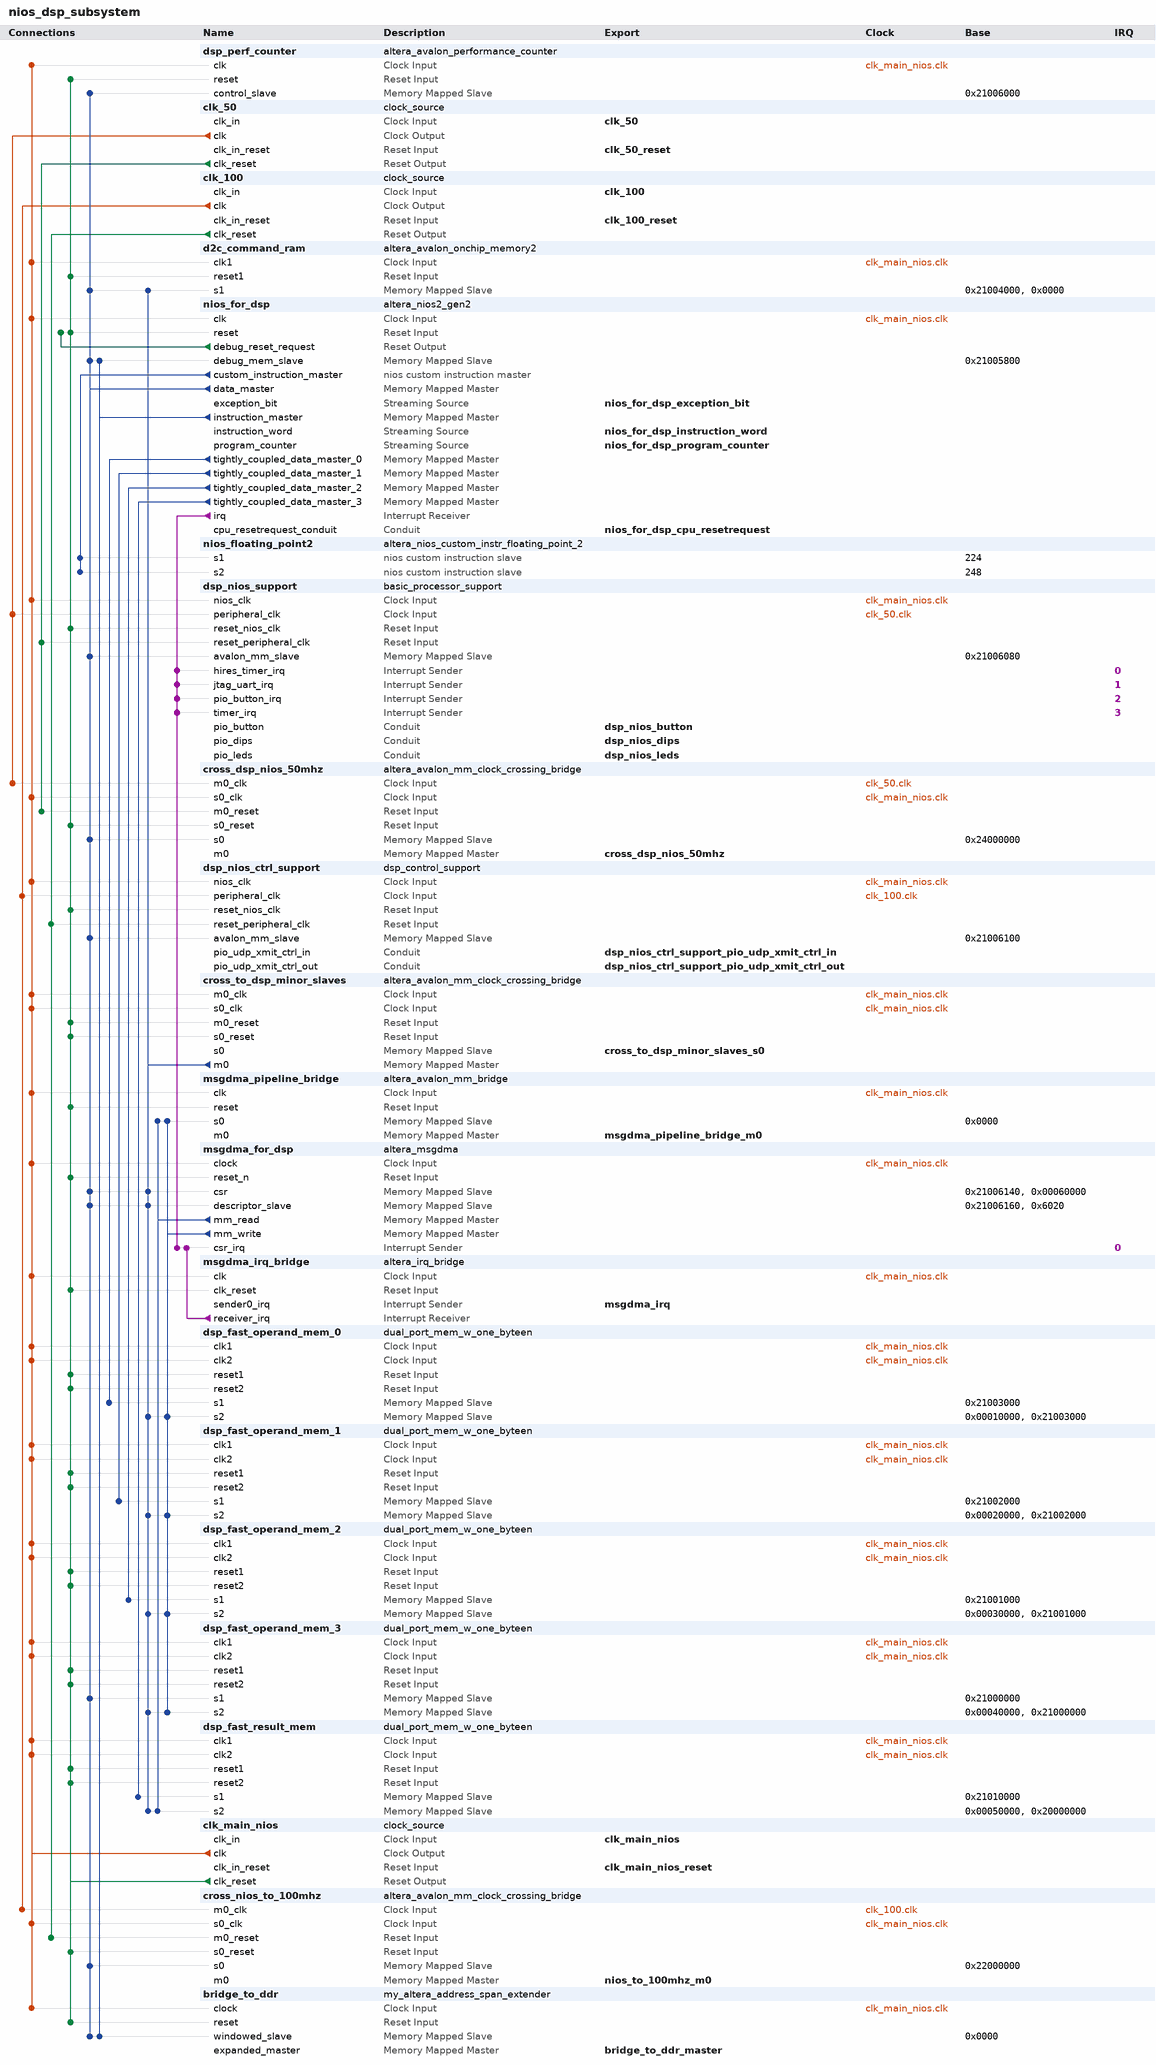
[diagram p0: system contents]
# Platform Designer (Qsys) system nios_dsp_subsystem, Arria V 5AGXFB5H4F35C4
# Parameters at their usual value, and those the tool derives, are not listed.
package require -exact qsys 16.1
create_system nios_dsp_subsystem
set_project_property DEVICE_FAMILY {Arria V}
set_project_property DEVICE 5AGXFB5H4F35C4

add_instance dsp_perf_counter altera_avalon_performance_counter 16.1
set_instance_parameter_value dsp_perf_counter numberOfSections 7

add_instance clk_50 clock_source 16.1
set_instance_parameter_value clk_50 clockFrequency 50000000
set_instance_parameter_value clk_50 resetSynchronousEdges BOTH

add_instance clk_100 clock_source 16.1
set_instance_parameter_value clk_100 clockFrequency 100000000
set_instance_parameter_value clk_100 resetSynchronousEdges BOTH

add_instance d2c_command_ram altera_avalon_onchip_memory2 16.1
set_instance_parameter_value d2c_command_ram allowInSystemMemoryContentEditor true
set_instance_parameter_value d2c_command_ram dataWidth 32
set_instance_parameter_value d2c_command_ram dualPort false
set_instance_parameter_value d2c_command_ram initMemContent true
set_instance_parameter_value d2c_command_ram initializationFileName onchip_mem.hex
set_instance_parameter_value d2c_command_ram instanceID d2c
set_instance_parameter_value d2c_command_ram memorySize 4096
set_instance_parameter_value d2c_command_ram slave1Latency 2

add_instance nios_for_dsp altera_nios2_gen2 16.1
set_instance_parameter_value nios_for_dsp cpuID 3419
set_instance_parameter_value nios_for_dsp cpuReset true
set_instance_parameter_value nios_for_dsp dcache_numTCDM 4
set_instance_parameter_value nios_for_dsp dcache_size 0
set_instance_parameter_value nios_for_dsp dividerType srt2
set_instance_parameter_value nios_for_dsp exceptionSlave bridge_to_ddr.windowed_slave
set_instance_parameter_value nios_for_dsp icache_burstType Sequential
set_instance_parameter_value nios_for_dsp icache_size 16384
set_instance_parameter_value nios_for_dsp impl Fast
set_instance_parameter_value nios_for_dsp mul_32_impl 3
set_instance_parameter_value nios_for_dsp mul_shift_choice 1
set_instance_parameter_value nios_for_dsp resetSlave bridge_to_ddr.windowed_slave
set_instance_parameter_value nios_for_dsp setting_showUnpublishedSettings true

add_instance nios_floating_point2 altera_nios_custom_instr_floating_point_2 16.1
set_instance_parameter_value nios_floating_point2 arithmetic_present true
set_instance_parameter_value nios_floating_point2 comparison_present true
set_instance_parameter_value nios_floating_point2 conversion_present true
set_instance_parameter_value nios_floating_point2 root_present true

add_instance dsp_nios_support basic_processor_support 1.0

add_instance cross_dsp_nios_50mhz altera_avalon_mm_clock_crossing_bridge 16.1
set_instance_parameter_value cross_dsp_nios_50mhz ADDRESS_WIDTH 10
set_instance_parameter_value cross_dsp_nios_50mhz COMMAND_FIFO_DEPTH 4
set_instance_parameter_value cross_dsp_nios_50mhz DATA_WIDTH 32
set_instance_parameter_value cross_dsp_nios_50mhz MASTER_SYNC_DEPTH 2
set_instance_parameter_value cross_dsp_nios_50mhz MAX_BURST_SIZE 1
set_instance_parameter_value cross_dsp_nios_50mhz RESPONSE_FIFO_DEPTH 4
set_instance_parameter_value cross_dsp_nios_50mhz SLAVE_SYNC_DEPTH 2
set_instance_parameter_value cross_dsp_nios_50mhz USE_AUTO_ADDRESS_WIDTH 1

add_instance dsp_nios_ctrl_support dsp_control_support 1.0

add_instance cross_to_dsp_minor_slaves altera_avalon_mm_clock_crossing_bridge 16.1
set_instance_parameter_value cross_to_dsp_minor_slaves ADDRESS_WIDTH 10
set_instance_parameter_value cross_to_dsp_minor_slaves COMMAND_FIFO_DEPTH 16
set_instance_parameter_value cross_to_dsp_minor_slaves DATA_WIDTH 128
set_instance_parameter_value cross_to_dsp_minor_slaves MASTER_SYNC_DEPTH 2
set_instance_parameter_value cross_to_dsp_minor_slaves MAX_BURST_SIZE 1
set_instance_parameter_value cross_to_dsp_minor_slaves RESPONSE_FIFO_DEPTH 16
set_instance_parameter_value cross_to_dsp_minor_slaves SLAVE_SYNC_DEPTH 2
set_instance_parameter_value cross_to_dsp_minor_slaves USE_AUTO_ADDRESS_WIDTH 1

add_instance msgdma_pipeline_bridge altera_avalon_mm_bridge 16.1
set_instance_parameter_value msgdma_pipeline_bridge ADDRESS_UNITS SYMBOLS
set_instance_parameter_value msgdma_pipeline_bridge ADDRESS_WIDTH 10
set_instance_parameter_value msgdma_pipeline_bridge DATA_WIDTH 256
set_instance_parameter_value msgdma_pipeline_bridge MAX_BURST_SIZE 8
set_instance_parameter_value msgdma_pipeline_bridge MAX_PENDING_RESPONSES 4
set_instance_parameter_value msgdma_pipeline_bridge USE_AUTO_ADDRESS_WIDTH 1

add_instance msgdma_for_dsp altera_msgdma 16.1
set_instance_parameter_value msgdma_for_dsp BURST_ENABLE 1
set_instance_parameter_value msgdma_for_dsp BURST_WRAPPING_SUPPORT 1
set_instance_parameter_value msgdma_for_dsp DATA_FIFO_DEPTH 32
set_instance_parameter_value msgdma_for_dsp DATA_WIDTH 128
set_instance_parameter_value msgdma_for_dsp DESCRIPTOR_FIFO_DEPTH 128
set_instance_parameter_value msgdma_for_dsp ENHANCED_FEATURES 0
set_instance_parameter_value msgdma_for_dsp ERROR_ENABLE 0
set_instance_parameter_value msgdma_for_dsp MAX_BURST_COUNT 8
set_instance_parameter_value msgdma_for_dsp MAX_BYTE 67108864
set_instance_parameter_value msgdma_for_dsp MODE 0
set_instance_parameter_value msgdma_for_dsp PACKET_ENABLE 0
set_instance_parameter_value msgdma_for_dsp TRANSFER_TYPE {Aligned Accesses}
set_instance_parameter_value msgdma_for_dsp USE_FIX_ADDRESS_WIDTH 1

add_instance msgdma_irq_bridge altera_irq_bridge 16.1
set_instance_parameter_value msgdma_irq_bridge IRQ_WIDTH 1

add_instance dsp_fast_operand_mem_0 dual_port_mem_w_one_byteen 16.1
set_instance_parameter_value dsp_fast_operand_mem_0 allowInSystemMemoryContentEditor false
set_instance_parameter_value dsp_fast_operand_mem_0 blockType AUTO
set_instance_parameter_value dsp_fast_operand_mem_0 copyInitFile false
set_instance_parameter_value dsp_fast_operand_mem_0 dataWidth 32
set_instance_parameter_value dsp_fast_operand_mem_0 dataWidth2 128
set_instance_parameter_value dsp_fast_operand_mem_0 dualPort true
set_instance_parameter_value dsp_fast_operand_mem_0 ecc_enabled false
set_instance_parameter_value dsp_fast_operand_mem_0 enPRInitMode false
set_instance_parameter_value dsp_fast_operand_mem_0 enableDiffWidth true
set_instance_parameter_value dsp_fast_operand_mem_0 initMemContent true
set_instance_parameter_value dsp_fast_operand_mem_0 initializationFileName onchip_mem.hex
set_instance_parameter_value dsp_fast_operand_mem_0 instanceID NONE
set_instance_parameter_value dsp_fast_operand_mem_0 memorySize 4096
set_instance_parameter_value dsp_fast_operand_mem_0 readDuringWriteMode DONT_CARE
set_instance_parameter_value dsp_fast_operand_mem_0 resetrequest_enabled true
set_instance_parameter_value dsp_fast_operand_mem_0 simAllowMRAMContentsFile false
set_instance_parameter_value dsp_fast_operand_mem_0 simMemInitOnlyFilename 0
set_instance_parameter_value dsp_fast_operand_mem_0 singleClockOperation false
set_instance_parameter_value dsp_fast_operand_mem_0 slave1Latency 1
set_instance_parameter_value dsp_fast_operand_mem_0 slave2Latency 1
set_instance_parameter_value dsp_fast_operand_mem_0 useNonDefaultInitFile false
set_instance_parameter_value dsp_fast_operand_mem_0 useShallowMemBlocks false
set_instance_parameter_value dsp_fast_operand_mem_0 writable true

add_instance dsp_fast_operand_mem_1 dual_port_mem_w_one_byteen 16.1
set_instance_parameter_value dsp_fast_operand_mem_1 allowInSystemMemoryContentEditor false
set_instance_parameter_value dsp_fast_operand_mem_1 blockType AUTO
set_instance_parameter_value dsp_fast_operand_mem_1 copyInitFile false
set_instance_parameter_value dsp_fast_operand_mem_1 dataWidth 32
set_instance_parameter_value dsp_fast_operand_mem_1 dataWidth2 128
set_instance_parameter_value dsp_fast_operand_mem_1 dualPort true
set_instance_parameter_value dsp_fast_operand_mem_1 ecc_enabled false
set_instance_parameter_value dsp_fast_operand_mem_1 enPRInitMode false
set_instance_parameter_value dsp_fast_operand_mem_1 enableDiffWidth true
set_instance_parameter_value dsp_fast_operand_mem_1 initMemContent true
set_instance_parameter_value dsp_fast_operand_mem_1 initializationFileName onchip_mem.hex
set_instance_parameter_value dsp_fast_operand_mem_1 instanceID NONE
set_instance_parameter_value dsp_fast_operand_mem_1 memorySize 4096
set_instance_parameter_value dsp_fast_operand_mem_1 readDuringWriteMode DONT_CARE
set_instance_parameter_value dsp_fast_operand_mem_1 resetrequest_enabled true
set_instance_parameter_value dsp_fast_operand_mem_1 simAllowMRAMContentsFile false
set_instance_parameter_value dsp_fast_operand_mem_1 simMemInitOnlyFilename 0
set_instance_parameter_value dsp_fast_operand_mem_1 singleClockOperation false
set_instance_parameter_value dsp_fast_operand_mem_1 slave1Latency 1
set_instance_parameter_value dsp_fast_operand_mem_1 slave2Latency 1
set_instance_parameter_value dsp_fast_operand_mem_1 useNonDefaultInitFile false
set_instance_parameter_value dsp_fast_operand_mem_1 useShallowMemBlocks false
set_instance_parameter_value dsp_fast_operand_mem_1 writable true

add_instance dsp_fast_operand_mem_2 dual_port_mem_w_one_byteen 16.1
set_instance_parameter_value dsp_fast_operand_mem_2 allowInSystemMemoryContentEditor false
set_instance_parameter_value dsp_fast_operand_mem_2 blockType AUTO
set_instance_parameter_value dsp_fast_operand_mem_2 copyInitFile false
set_instance_parameter_value dsp_fast_operand_mem_2 dataWidth 32
set_instance_parameter_value dsp_fast_operand_mem_2 dataWidth2 128
set_instance_parameter_value dsp_fast_operand_mem_2 dualPort true
set_instance_parameter_value dsp_fast_operand_mem_2 ecc_enabled false
set_instance_parameter_value dsp_fast_operand_mem_2 enPRInitMode false
set_instance_parameter_value dsp_fast_operand_mem_2 enableDiffWidth true
set_instance_parameter_value dsp_fast_operand_mem_2 initMemContent true
set_instance_parameter_value dsp_fast_operand_mem_2 initializationFileName onchip_mem.hex
set_instance_parameter_value dsp_fast_operand_mem_2 instanceID NONE
set_instance_parameter_value dsp_fast_operand_mem_2 memorySize 4096
set_instance_parameter_value dsp_fast_operand_mem_2 readDuringWriteMode DONT_CARE
set_instance_parameter_value dsp_fast_operand_mem_2 resetrequest_enabled true
set_instance_parameter_value dsp_fast_operand_mem_2 simAllowMRAMContentsFile false
set_instance_parameter_value dsp_fast_operand_mem_2 simMemInitOnlyFilename 0
set_instance_parameter_value dsp_fast_operand_mem_2 singleClockOperation false
set_instance_parameter_value dsp_fast_operand_mem_2 slave1Latency 1
set_instance_parameter_value dsp_fast_operand_mem_2 slave2Latency 1
set_instance_parameter_value dsp_fast_operand_mem_2 useNonDefaultInitFile false
set_instance_parameter_value dsp_fast_operand_mem_2 useShallowMemBlocks false
set_instance_parameter_value dsp_fast_operand_mem_2 writable true

add_instance dsp_fast_operand_mem_3 dual_port_mem_w_one_byteen 16.1
set_instance_parameter_value dsp_fast_operand_mem_3 allowInSystemMemoryContentEditor false
set_instance_parameter_value dsp_fast_operand_mem_3 blockType AUTO
set_instance_parameter_value dsp_fast_operand_mem_3 copyInitFile false
set_instance_parameter_value dsp_fast_operand_mem_3 dataWidth 32
set_instance_parameter_value dsp_fast_operand_mem_3 dataWidth2 128
set_instance_parameter_value dsp_fast_operand_mem_3 dualPort true
set_instance_parameter_value dsp_fast_operand_mem_3 ecc_enabled false
set_instance_parameter_value dsp_fast_operand_mem_3 enPRInitMode false
set_instance_parameter_value dsp_fast_operand_mem_3 enableDiffWidth true
set_instance_parameter_value dsp_fast_operand_mem_3 initMemContent true
set_instance_parameter_value dsp_fast_operand_mem_3 initializationFileName onchip_mem.hex
set_instance_parameter_value dsp_fast_operand_mem_3 instanceID NONE
set_instance_parameter_value dsp_fast_operand_mem_3 memorySize 4096
set_instance_parameter_value dsp_fast_operand_mem_3 readDuringWriteMode DONT_CARE
set_instance_parameter_value dsp_fast_operand_mem_3 resetrequest_enabled true
set_instance_parameter_value dsp_fast_operand_mem_3 simAllowMRAMContentsFile false
set_instance_parameter_value dsp_fast_operand_mem_3 simMemInitOnlyFilename 0
set_instance_parameter_value dsp_fast_operand_mem_3 singleClockOperation false
set_instance_parameter_value dsp_fast_operand_mem_3 slave1Latency 1
set_instance_parameter_value dsp_fast_operand_mem_3 slave2Latency 1
set_instance_parameter_value dsp_fast_operand_mem_3 useNonDefaultInitFile false
set_instance_parameter_value dsp_fast_operand_mem_3 useShallowMemBlocks false
set_instance_parameter_value dsp_fast_operand_mem_3 writable true

add_instance dsp_fast_result_mem dual_port_mem_w_one_byteen 16.1
set_instance_parameter_value dsp_fast_result_mem allowInSystemMemoryContentEditor false
set_instance_parameter_value dsp_fast_result_mem blockType AUTO
set_instance_parameter_value dsp_fast_result_mem copyInitFile false
set_instance_parameter_value dsp_fast_result_mem dataWidth 32
set_instance_parameter_value dsp_fast_result_mem dataWidth2 128
set_instance_parameter_value dsp_fast_result_mem dualPort true
set_instance_parameter_value dsp_fast_result_mem ecc_enabled false
set_instance_parameter_value dsp_fast_result_mem enPRInitMode false
set_instance_parameter_value dsp_fast_result_mem enableDiffWidth true
set_instance_parameter_value dsp_fast_result_mem initMemContent true
set_instance_parameter_value dsp_fast_result_mem initializationFileName onchip_mem.hex
set_instance_parameter_value dsp_fast_result_mem instanceID NONE
set_instance_parameter_value dsp_fast_result_mem memorySize 4096
set_instance_parameter_value dsp_fast_result_mem readDuringWriteMode DONT_CARE
set_instance_parameter_value dsp_fast_result_mem resetrequest_enabled true
set_instance_parameter_value dsp_fast_result_mem simAllowMRAMContentsFile false
set_instance_parameter_value dsp_fast_result_mem simMemInitOnlyFilename 0
set_instance_parameter_value dsp_fast_result_mem singleClockOperation false
set_instance_parameter_value dsp_fast_result_mem slave1Latency 1
set_instance_parameter_value dsp_fast_result_mem slave2Latency 1
set_instance_parameter_value dsp_fast_result_mem useNonDefaultInitFile false
set_instance_parameter_value dsp_fast_result_mem useShallowMemBlocks false
set_instance_parameter_value dsp_fast_result_mem writable true

add_instance clk_main_nios clock_source 16.1
set_instance_parameter_value clk_main_nios clockFrequency 150000000
set_instance_parameter_value clk_main_nios resetSynchronousEdges BOTH

add_instance cross_nios_to_100mhz altera_avalon_mm_clock_crossing_bridge 16.1
set_instance_parameter_value cross_nios_to_100mhz ADDRESS_WIDTH 28
set_instance_parameter_value cross_nios_to_100mhz COMMAND_FIFO_DEPTH 4
set_instance_parameter_value cross_nios_to_100mhz DATA_WIDTH 32
set_instance_parameter_value cross_nios_to_100mhz MASTER_SYNC_DEPTH 2
set_instance_parameter_value cross_nios_to_100mhz MAX_BURST_SIZE 1
set_instance_parameter_value cross_nios_to_100mhz RESPONSE_FIFO_DEPTH 4
set_instance_parameter_value cross_nios_to_100mhz SLAVE_SYNC_DEPTH 2
set_instance_parameter_value cross_nios_to_100mhz USE_AUTO_ADDRESS_WIDTH 1

add_instance bridge_to_ddr my_altera_address_span_extender 16.1
set_instance_parameter_value bridge_to_ddr BURSTCOUNT_WIDTH 4
set_instance_parameter_value bridge_to_ddr DATA_WIDTH 256
set_instance_parameter_value bridge_to_ddr ENABLE_SLAVE_PORT true
set_instance_parameter_value bridge_to_ddr MASTER_ADDRESS_DEF 0
set_instance_parameter_value bridge_to_ddr MASTER_ADDRESS_WIDTH 32
set_instance_parameter_value bridge_to_ddr MAX_PENDING_READS 32
set_instance_parameter_value bridge_to_ddr SLAVE_ADDRESS_WIDTH 24
set_instance_parameter_value bridge_to_ddr SUB_WINDOW_COUNT 1

# connections
add_connection clk_50.clk cross_dsp_nios_50mhz.m0_clk clock
add_connection clk_50.clk dsp_nios_support.peripheral_clk clock
add_connection clk_100.clk cross_nios_to_100mhz.m0_clk clock
add_connection clk_100.clk dsp_nios_ctrl_support.peripheral_clk clock
add_connection clk_main_nios.clk bridge_to_ddr.clock clock
add_connection clk_main_nios.clk cross_dsp_nios_50mhz.s0_clk clock
add_connection clk_main_nios.clk cross_nios_to_100mhz.s0_clk clock
add_connection clk_main_nios.clk cross_to_dsp_minor_slaves.m0_clk clock
add_connection clk_main_nios.clk cross_to_dsp_minor_slaves.s0_clk clock
add_connection clk_main_nios.clk d2c_command_ram.clk1 clock
add_connection clk_main_nios.clk dsp_fast_operand_mem_0.clk1 clock
add_connection clk_main_nios.clk dsp_fast_operand_mem_0.clk2 clock
add_connection clk_main_nios.clk dsp_fast_operand_mem_1.clk1 clock
add_connection clk_main_nios.clk dsp_fast_operand_mem_1.clk2 clock
add_connection clk_main_nios.clk dsp_fast_operand_mem_2.clk1 clock
add_connection clk_main_nios.clk dsp_fast_operand_mem_2.clk2 clock
add_connection clk_main_nios.clk dsp_fast_operand_mem_3.clk1 clock
add_connection clk_main_nios.clk dsp_fast_operand_mem_3.clk2 clock
add_connection clk_main_nios.clk dsp_fast_result_mem.clk1 clock
add_connection clk_main_nios.clk dsp_fast_result_mem.clk2 clock
add_connection clk_main_nios.clk dsp_nios_ctrl_support.nios_clk clock
add_connection clk_main_nios.clk dsp_nios_support.nios_clk clock
add_connection clk_main_nios.clk dsp_perf_counter.clk clock
add_connection clk_main_nios.clk msgdma_for_dsp.clock clock
add_connection clk_main_nios.clk msgdma_irq_bridge.clk clock
add_connection clk_main_nios.clk msgdma_pipeline_bridge.clk clock
add_connection clk_main_nios.clk nios_for_dsp.clk clock
add_connection clk_50.clk_reset cross_dsp_nios_50mhz.m0_reset reset
add_connection clk_50.clk_reset dsp_nios_support.reset_peripheral_clk reset
add_connection clk_100.clk_reset cross_nios_to_100mhz.m0_reset reset
add_connection clk_100.clk_reset dsp_nios_ctrl_support.reset_peripheral_clk reset
add_connection clk_main_nios.clk_reset bridge_to_ddr.reset reset
add_connection clk_main_nios.clk_reset cross_dsp_nios_50mhz.s0_reset reset
add_connection clk_main_nios.clk_reset cross_nios_to_100mhz.s0_reset reset
add_connection clk_main_nios.clk_reset cross_to_dsp_minor_slaves.m0_reset reset
add_connection clk_main_nios.clk_reset cross_to_dsp_minor_slaves.s0_reset reset
add_connection clk_main_nios.clk_reset d2c_command_ram.reset1 reset
add_connection clk_main_nios.clk_reset dsp_fast_operand_mem_0.reset1 reset
add_connection clk_main_nios.clk_reset dsp_fast_operand_mem_0.reset2 reset
add_connection clk_main_nios.clk_reset dsp_fast_operand_mem_1.reset1 reset
add_connection clk_main_nios.clk_reset dsp_fast_operand_mem_1.reset2 reset
add_connection clk_main_nios.clk_reset dsp_fast_operand_mem_2.reset1 reset
add_connection clk_main_nios.clk_reset dsp_fast_operand_mem_2.reset2 reset
add_connection clk_main_nios.clk_reset dsp_fast_operand_mem_3.reset1 reset
add_connection clk_main_nios.clk_reset dsp_fast_operand_mem_3.reset2 reset
add_connection clk_main_nios.clk_reset dsp_fast_result_mem.reset1 reset
add_connection clk_main_nios.clk_reset dsp_fast_result_mem.reset2 reset
add_connection clk_main_nios.clk_reset dsp_nios_ctrl_support.reset_nios_clk reset
add_connection clk_main_nios.clk_reset dsp_nios_support.reset_nios_clk reset
add_connection clk_main_nios.clk_reset dsp_perf_counter.reset reset
add_connection clk_main_nios.clk_reset msgdma_for_dsp.reset_n reset
add_connection clk_main_nios.clk_reset msgdma_irq_bridge.clk_reset reset
add_connection clk_main_nios.clk_reset msgdma_pipeline_bridge.reset reset
add_connection clk_main_nios.clk_reset nios_for_dsp.reset reset
add_connection nios_for_dsp.debug_reset_request nios_for_dsp.reset reset
add_connection cross_to_dsp_minor_slaves.m0 d2c_command_ram.s1 avalon
set_connection_parameter_value cross_to_dsp_minor_slaves.m0/d2c_command_ram.s1 baseAddress 0x0000
add_connection cross_to_dsp_minor_slaves.m0 dsp_fast_operand_mem_0.s2 avalon
set_connection_parameter_value cross_to_dsp_minor_slaves.m0/dsp_fast_operand_mem_0.s2 baseAddress 0x00010000
add_connection cross_to_dsp_minor_slaves.m0 dsp_fast_operand_mem_1.s2 avalon
set_connection_parameter_value cross_to_dsp_minor_slaves.m0/dsp_fast_operand_mem_1.s2 baseAddress 0x00020000
add_connection cross_to_dsp_minor_slaves.m0 dsp_fast_operand_mem_2.s2 avalon
set_connection_parameter_value cross_to_dsp_minor_slaves.m0/dsp_fast_operand_mem_2.s2 baseAddress 0x00030000
add_connection cross_to_dsp_minor_slaves.m0 dsp_fast_operand_mem_3.s2 avalon
set_connection_parameter_value cross_to_dsp_minor_slaves.m0/dsp_fast_operand_mem_3.s2 baseAddress 0x00040000
add_connection cross_to_dsp_minor_slaves.m0 dsp_fast_result_mem.s2 avalon
set_connection_parameter_value cross_to_dsp_minor_slaves.m0/dsp_fast_result_mem.s2 baseAddress 0x00050000
add_connection cross_to_dsp_minor_slaves.m0 msgdma_for_dsp.csr avalon
set_connection_parameter_value cross_to_dsp_minor_slaves.m0/msgdma_for_dsp.csr baseAddress 0x00060000
add_connection cross_to_dsp_minor_slaves.m0 msgdma_for_dsp.descriptor_slave avalon
set_connection_parameter_value cross_to_dsp_minor_slaves.m0/msgdma_for_dsp.descriptor_slave baseAddress 0x6020
add_connection msgdma_for_dsp.mm_read dsp_fast_result_mem.s2 avalon
set_connection_parameter_value msgdma_for_dsp.mm_read/dsp_fast_result_mem.s2 baseAddress 0x20000000
add_connection msgdma_for_dsp.mm_read msgdma_pipeline_bridge.s0 avalon
set_connection_parameter_value msgdma_for_dsp.mm_read/msgdma_pipeline_bridge.s0 baseAddress 0x0000
add_connection msgdma_for_dsp.mm_write dsp_fast_operand_mem_0.s2 avalon
set_connection_parameter_value msgdma_for_dsp.mm_write/dsp_fast_operand_mem_0.s2 baseAddress 0x21003000
add_connection msgdma_for_dsp.mm_write dsp_fast_operand_mem_1.s2 avalon
set_connection_parameter_value msgdma_for_dsp.mm_write/dsp_fast_operand_mem_1.s2 baseAddress 0x21002000
add_connection msgdma_for_dsp.mm_write dsp_fast_operand_mem_2.s2 avalon
set_connection_parameter_value msgdma_for_dsp.mm_write/dsp_fast_operand_mem_2.s2 baseAddress 0x21001000
add_connection msgdma_for_dsp.mm_write dsp_fast_operand_mem_3.s2 avalon
set_connection_parameter_value msgdma_for_dsp.mm_write/dsp_fast_operand_mem_3.s2 baseAddress 0x21000000
add_connection msgdma_for_dsp.mm_write msgdma_pipeline_bridge.s0 avalon
set_connection_parameter_value msgdma_for_dsp.mm_write/msgdma_pipeline_bridge.s0 baseAddress 0x0000
add_connection nios_for_dsp.data_master bridge_to_ddr.windowed_slave avalon
set_connection_parameter_value nios_for_dsp.data_master/bridge_to_ddr.windowed_slave baseAddress 0x0000
add_connection nios_for_dsp.data_master cross_dsp_nios_50mhz.s0 avalon
set_connection_parameter_value nios_for_dsp.data_master/cross_dsp_nios_50mhz.s0 baseAddress 0x24000000
add_connection nios_for_dsp.data_master cross_nios_to_100mhz.s0 avalon
set_connection_parameter_value nios_for_dsp.data_master/cross_nios_to_100mhz.s0 baseAddress 0x22000000
add_connection nios_for_dsp.data_master d2c_command_ram.s1 avalon
set_connection_parameter_value nios_for_dsp.data_master/d2c_command_ram.s1 baseAddress 0x21004000
add_connection nios_for_dsp.data_master dsp_fast_operand_mem_3.s1 avalon
set_connection_parameter_value nios_for_dsp.data_master/dsp_fast_operand_mem_3.s1 baseAddress 0x21000000
add_connection nios_for_dsp.data_master dsp_nios_ctrl_support.avalon_mm_slave avalon
set_connection_parameter_value nios_for_dsp.data_master/dsp_nios_ctrl_support.avalon_mm_slave baseAddress 0x21006100
add_connection nios_for_dsp.data_master dsp_nios_support.avalon_mm_slave avalon
set_connection_parameter_value nios_for_dsp.data_master/dsp_nios_support.avalon_mm_slave baseAddress 0x21006080
add_connection nios_for_dsp.data_master dsp_perf_counter.control_slave avalon
set_connection_parameter_value nios_for_dsp.data_master/dsp_perf_counter.control_slave baseAddress 0x21006000
add_connection nios_for_dsp.data_master msgdma_for_dsp.csr avalon
set_connection_parameter_value nios_for_dsp.data_master/msgdma_for_dsp.csr baseAddress 0x21006140
add_connection nios_for_dsp.data_master msgdma_for_dsp.descriptor_slave avalon
set_connection_parameter_value nios_for_dsp.data_master/msgdma_for_dsp.descriptor_slave baseAddress 0x21006160
add_connection nios_for_dsp.data_master nios_for_dsp.debug_mem_slave avalon
set_connection_parameter_value nios_for_dsp.data_master/nios_for_dsp.debug_mem_slave baseAddress 0x21005800
add_connection nios_for_dsp.instruction_master bridge_to_ddr.windowed_slave avalon
set_connection_parameter_value nios_for_dsp.instruction_master/bridge_to_ddr.windowed_slave baseAddress 0x0000
add_connection nios_for_dsp.instruction_master nios_for_dsp.debug_mem_slave avalon
set_connection_parameter_value nios_for_dsp.instruction_master/nios_for_dsp.debug_mem_slave baseAddress 0x21005800
add_connection nios_for_dsp.tightly_coupled_data_master_0 dsp_fast_operand_mem_0.s1 avalon
set_connection_parameter_value nios_for_dsp.tightly_coupled_data_master_0/dsp_fast_operand_mem_0.s1 baseAddress 0x21003000
add_connection nios_for_dsp.tightly_coupled_data_master_1 dsp_fast_operand_mem_1.s1 avalon
set_connection_parameter_value nios_for_dsp.tightly_coupled_data_master_1/dsp_fast_operand_mem_1.s1 baseAddress 0x21002000
add_connection nios_for_dsp.tightly_coupled_data_master_2 dsp_fast_operand_mem_2.s1 avalon
set_connection_parameter_value nios_for_dsp.tightly_coupled_data_master_2/dsp_fast_operand_mem_2.s1 baseAddress 0x21001000
add_connection nios_for_dsp.tightly_coupled_data_master_3 dsp_fast_result_mem.s1 avalon
set_connection_parameter_value nios_for_dsp.tightly_coupled_data_master_3/dsp_fast_result_mem.s1 baseAddress 0x21010000
add_connection msgdma_irq_bridge.receiver_irq msgdma_for_dsp.csr_irq interrupt
set_connection_parameter_value msgdma_irq_bridge.receiver_irq/msgdma_for_dsp.csr_irq irqNumber 0
add_connection nios_for_dsp.irq dsp_nios_support.hires_timer_irq interrupt
set_connection_parameter_value nios_for_dsp.irq/dsp_nios_support.hires_timer_irq irqNumber 0
add_connection nios_for_dsp.irq dsp_nios_support.jtag_uart_irq interrupt
set_connection_parameter_value nios_for_dsp.irq/dsp_nios_support.jtag_uart_irq irqNumber 1
add_connection nios_for_dsp.irq dsp_nios_support.pio_button_irq interrupt
set_connection_parameter_value nios_for_dsp.irq/dsp_nios_support.pio_button_irq irqNumber 2
add_connection nios_for_dsp.irq dsp_nios_support.timer_irq interrupt
set_connection_parameter_value nios_for_dsp.irq/dsp_nios_support.timer_irq irqNumber 3
add_connection nios_for_dsp.irq msgdma_for_dsp.csr_irq interrupt
set_connection_parameter_value nios_for_dsp.irq/msgdma_for_dsp.csr_irq irqNumber 4
add_connection nios_for_dsp.custom_instruction_master nios_floating_point2.s1 nios_custom_instruction
set_connection_parameter_value nios_for_dsp.custom_instruction_master/nios_floating_point2.s1 CIName nios_floating_point2
set_connection_parameter_value nios_for_dsp.custom_instruction_master/nios_floating_point2.s1 baseAddress 224
add_connection nios_for_dsp.custom_instruction_master nios_floating_point2.s2 nios_custom_instruction
set_connection_parameter_value nios_for_dsp.custom_instruction_master/nios_floating_point2.s2 CIName nios_floating_point2_1
set_connection_parameter_value nios_for_dsp.custom_instruction_master/nios_floating_point2.s2 baseAddress 248

# exported interfaces
add_interface bridge_to_ddr_master avalon master
set_interface_property bridge_to_ddr_master EXPORT_OF bridge_to_ddr.expanded_master
add_interface clk_100 clock sink
set_interface_property clk_100 EXPORT_OF clk_100.clk_in
add_interface clk_100_reset reset sink
set_interface_property clk_100_reset EXPORT_OF clk_100.clk_in_reset
add_interface clk_50 clock sink
set_interface_property clk_50 EXPORT_OF clk_50.clk_in
add_interface clk_50_reset reset sink
set_interface_property clk_50_reset EXPORT_OF clk_50.clk_in_reset
add_interface clk_main_nios clock sink
set_interface_property clk_main_nios EXPORT_OF clk_main_nios.clk_in
add_interface clk_main_nios_reset reset sink
set_interface_property clk_main_nios_reset EXPORT_OF clk_main_nios.clk_in_reset
add_interface cross_dsp_nios_50mhz avalon master
set_interface_property cross_dsp_nios_50mhz EXPORT_OF cross_dsp_nios_50mhz.m0
add_interface cross_to_dsp_minor_slaves_s0 avalon slave
set_interface_property cross_to_dsp_minor_slaves_s0 EXPORT_OF cross_to_dsp_minor_slaves.s0
add_interface dsp_nios_button conduit end
set_interface_property dsp_nios_button EXPORT_OF dsp_nios_support.pio_button
add_interface dsp_nios_ctrl_support_pio_udp_xmit_ctrl_in conduit end
set_interface_property dsp_nios_ctrl_support_pio_udp_xmit_ctrl_in EXPORT_OF dsp_nios_ctrl_support.pio_udp_xmit_ctrl_in
add_interface dsp_nios_ctrl_support_pio_udp_xmit_ctrl_out conduit end
set_interface_property dsp_nios_ctrl_support_pio_udp_xmit_ctrl_out EXPORT_OF dsp_nios_ctrl_support.pio_udp_xmit_ctrl_out
add_interface dsp_nios_dips conduit end
set_interface_property dsp_nios_dips EXPORT_OF dsp_nios_support.pio_dips
add_interface dsp_nios_leds conduit end
set_interface_property dsp_nios_leds EXPORT_OF dsp_nios_support.pio_leds
add_interface msgdma_irq interrupt sender
set_interface_property msgdma_irq EXPORT_OF msgdma_irq_bridge.sender0_irq
add_interface msgdma_pipeline_bridge_m0 avalon master
set_interface_property msgdma_pipeline_bridge_m0 EXPORT_OF msgdma_pipeline_bridge.m0
add_interface nios_for_dsp_cpu_resetrequest conduit end
set_interface_property nios_for_dsp_cpu_resetrequest EXPORT_OF nios_for_dsp.cpu_resetrequest_conduit
add_interface nios_for_dsp_exception_bit avalon_streaming source
set_interface_property nios_for_dsp_exception_bit EXPORT_OF nios_for_dsp.exception_bit
add_interface nios_for_dsp_instruction_word avalon_streaming source
set_interface_property nios_for_dsp_instruction_word EXPORT_OF nios_for_dsp.instruction_word
add_interface nios_for_dsp_program_counter avalon_streaming source
set_interface_property nios_for_dsp_program_counter EXPORT_OF nios_for_dsp.program_counter
add_interface nios_to_100mhz_m0 avalon master
set_interface_property nios_to_100mhz_m0 EXPORT_OF cross_nios_to_100mhz.m0

set_interconnect_requirement {$system} qsys_mm.clockCrossingAdapter AUTO
set_interconnect_requirement {$system} qsys_mm.insertDefaultSlave FALSE
set_interconnect_requirement {$system} qsys_mm.maxAdditionalLatency 4

save_system nios_dsp_subsystem.qsys
